# Altium project Hall_Sensor.PrjPcb
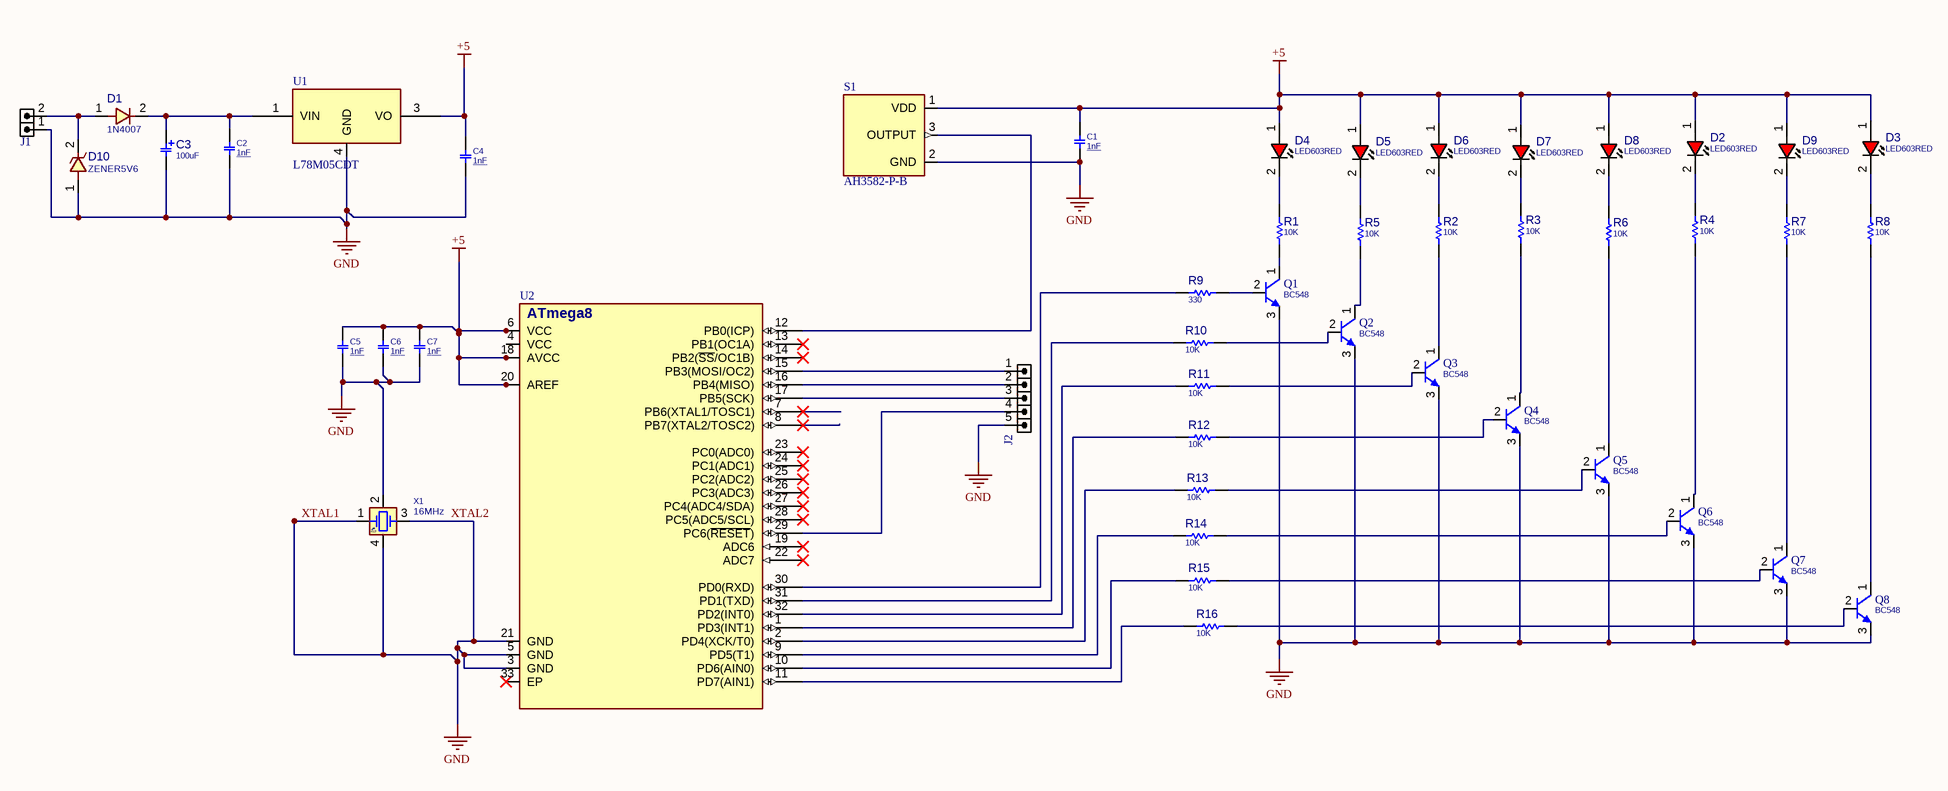
[diagram p0: Shematic_Hall_Sensor_App.SchDoc]
1 sheet, 47 parts. Net scope: global (net labels, ports and power ports of the same name join across sheets).
Board files: PCB_Hall_Sensor.PcbDoc, PCB_Hall_Sensor_Panel.PcbDoc

## Sheet Shematic_Hall_Sensor_App.SchDoc
size 431 x 279 mm; Organization: ORGANIZATION; Address1: ADDRESS 1; Address2: ADDRESS 2; Address3: ADDRESS 3; Address4: ADDRESS 4; Revision: -; SheetNumber: 1; SheetTotal: 1; ENG_APP_DATE: --/--/--; DSN_APP_DATE: --/--/--; CHK_APP_DATE: --/--/--

### Parts
C1  1nF  [C0402]
C2  1nF  [C0402]
C3  100uF  [C_EL_8]
C4  1nF  [C0402]
C5  1nF  [C0402]
C6  1nF  [C0402]
C7  1nF  [C0402]
D1  1N4007  [D_SMA]
D2  LED603RED  [LED0603RED]
D3  LED603RED  [LED0603RED]
D4  LED603RED  [LED0603RED]
D5  LED603RED  [LED0603RED]
D6  LED603RED  [LED0603RED]
D7  LED603RED  [LED0603RED]
D8  LED603RED  [LED0603RED]
D9  LED603RED  [LED0603RED]
D10  ZENER5V6  [D_SOD123W]
J1  HDRM2  [HDR_M_1X2]  (value not drawn)
J2  HDR1X5  [HDR_M_1X5]  (value not drawn)
Q1  BC548  [TO92_3]
Q2  BC548  [TO92_3]
Q3  BC548  [TO92_3]
Q4  BC548  [TO92_3]
Q5  BC548  [TO92_3]
Q6  BC548  [TO92_3]
Q7  BC548  [TO92_3]
Q8  BC548  [TO92_3]
R1  10K  [R0603]
R2  10K  [R0603]
R3  10K  [R0603]
R4  10K  [R0603]
R5  10K  [R0603]
R6  10K  [R0603]
R7  10K  [R0603]
R8  10K  [R0603]
R9  330  [R0603]
R10  10K  [R0603]
R11  10K  [R0603]
R12  10K  [R0603]
R13  10K  [R0603]
R14  10K  [R0603]
R15  10K  [R0603]
R16  10K  [R0603]
S1  AH3582-P-B  [SIP160W38P127L430H495Q3]
U1  L78M05CDT  [DPAK_3]
U2  ATMEGA8  [QFG80_32]  (value not drawn)
X1  16MHz  [XTL_4_2520]

### Nets
+5: C1.1 C4.1 C5.1 C6.1 C7.1 D2.1(ANODE) D3.1(ANODE) D4.1(ANODE) D5.1(ANODE) D6.1(ANODE) D7.1(ANODE) D8.1(ANODE) D9.1(ANODE) S1.1(VDD) U1.3(VO) U2.6(VCC) U2.18(AVCC) U2.20(AREF)
XTAL1: C1.2 C2.2 C3.2 C4.2 C5.2 C6.2 C7.2 D10.1 J1.1 J2.5 Q1.3(E) Q2.3(E) Q3.3(E) Q4.3(E) Q5.3(E) Q6.3(E) Q7.3(E) Q8.3(E) S1.2(GND) U1.4(GND) U2.3(GND) U2.5(GND) U2.21(GND) X1.1 X1.2 X1.3 X1.4  [also labelled GND, XTAL2]
NetC2_1: C2.1 C3.1 D1.2 U1.1(VIN)
NetD1_1: D1.1 D10.2 J1.2
NetD2_2: D2.2(CATHODE) R4.2
NetD3_2: D3.2(CATHODE) R8.2
NetD4_2: D4.2(CATHODE) R1.2
NetD5_2: D5.2(CATHODE) R5.2
NetD6_2: D6.2(CATHODE) R2.2
NetD7_2: D7.2(CATHODE) R3.2
NetD8_2: D8.2(CATHODE) R6.2
NetD9_2: D9.2(CATHODE) R7.2
NetJ2_1: J2.1 U2.15(PB3(MOSI/OC2))
NetJ2_2: J2.2 U2.16(PB4(MISO))
NetJ2_3: J2.3 U2.17(PB5(SCK))
NetJ2_4: J2.4 U2.29(PC6(~{RESET}))
NetQ1_1: Q1.1(C) R1.1
NetQ1_2: Q1.2(B) R9.2
NetQ2_1: Q2.1(C) R5.1
NetQ2_2: Q2.2(B) R10.2
NetQ3_1: Q3.1(C) R2.1
NetQ3_2: Q3.2(B) R11.2
NetQ4_1: Q4.1(C) R3.1
NetQ4_2: Q4.2(B) R12.2
NetQ5_1: Q5.1(C) R6.1
NetQ5_2: Q5.2(B) R13.2
NetQ6_1: Q6.1(C) R4.1
NetQ6_2: Q6.2(B) R14.2
NetQ7_1: Q7.1(C) R7.1
NetQ7_2: Q7.2(B) R15.2
NetQ8_1: Q8.1(C) R8.1
NetQ8_2: Q8.2(B) R16.2
NetR9_1: R9.1 U2.30(PD0(RXD))
NetR10_1: R10.1 U2.31(PD1(TXD))
NetR11_1: R11.1 U2.32(PD2(INT0))
NetR12_1: R12.1 U2.1(PD3(INT1))
NetR13_1: R13.1 U2.2(PD4(XCK/T0))
NetR14_1: R14.1 U2.9(PD5(T1))
NetR15_1: R15.1 U2.10(PD6(AIN0))
NetR16_1: R16.1 U2.11(PD7(AIN1))
NetS1_3: S1.3(OUTPUT) U2.12(PB0(ICP))

Not connected (* = marked no-connect by the designer): U2 4(VCC) 7(PB6(XTAL1/TOSC1))* 8(PB7(XTAL2/TOSC2))* 13(PB1(OC1A))* 14(PB2(~{SS}/OC1B))* 19(ADC6)* 22(ADC7)* 23(PC0(ADC0))* 24(PC1(ADC1))* 25(PC2(ADC2))* 26(PC3(ADC3))* 27(PC4(ADC4/SDA))* 28(PC5(ADC5/SCL))* 33(EP)*

### Notes on the sheet
- DWG. NO.
- REV.
- SHT.
- THIS DOCUMENT AND THE DATA DISCLOSED HEREIN OR HEREWITH IS THE PROPERTY OF ALTIUM LIMITED AND MAY BE FREELY DISTRIBUTED IN WHOLE. NO RIGHTS ARE RESERVED OR EXPRESS OR IMPLIED WARANTEE GIVEN.
- REVISION
- DESCRIPTION
- DATE
- APPROVED
- ENG:
- APPROVALS
- PROJECT
- DSN:
- CHK:
- REFERENCE DOCUMENTS
- PROJECT REVISION:
- TITLE
- DOCUMENT REVISION:
- DESIGN ITEM:
- BOM:
- FAB DWG:
- PCB DWG:
- ASSY DWG:
- SCALE:
- SIZE
- B
- CAGE CODE
- FILE NAME
- DWG NO.
- SHEET
- OF
- REV
- (in symbol ATMEGA8_QFP32) ATmega8

### Library data of the parts
C1 C2 C4-C7 = CAP_SMD_MLCC: CAP, MLCC, 1nF, 50V, C0G, 10%, 0402; MANF_P#: MANF_PART#; MANF: Murata; PARAM: C0G, 10%; PRICE: 100= 1$; DESC: CAP, MLCC, 1nF, 50V, C0G, 10%, 0402; PARAM2: 50V; ASSEMBLY: ASSEMBLY; VALUE: 1nF
C3 = CAP_SMD_EL: CAP, THD, ELEC,; MANF_P#: MANF_PART#; PARAM2: -V; DESC: DESCRIPTION; DIST#: MOUSER; PARAM: 20%; PRICE: 10= -$; MANF: MANF; ASSEMBLY: ASSEMBLY; VALUE: 100uF
D1 = DIODE_SMD_1N4007: DIODE, GENERAL PURPOSE, 1000V/1A; MANF: Kingtronics; DESC: DESCRIPTION; PARAM: 1000V VRRM; PARAM2: 1A; MANF_P#: M7; ASSEMBLY: ASSEMBLY; PRICE: PRICE; VALUE: 1N4007
D2-D9 = LED_SMD_0603_RED: LED, SMD, 0603, RED; PARAM: 30mA, 640nm; DESC: DESCRIPTION; MANF_P#: MANF_PART#; PARAM2: 1.8~2.5V; MANF: MANF; ASSEMBLY: ASSEMBLY; PRICE: PRICE; VALUE: LED603RED
D10 = DIODE_SMD_ZENER_DFLZ5V6: DIODE, ZENER, 1W, 5.1V; MANF: Diodes; DESC: DESCRIPTION; PARAM2: 1W, 4Ohm, -55~150oC; PARAM: 5.6V; MANF_P#: DFLZ5V6-7; ASSEMBLY: ASSEMBLY; PRICE: 0.5$; VALUE: ZENER5V6
J1 = HDR_M_1X2: CONN, HEADER, Male, pitch: 2.54mm, 2POS; VALUE: HDRM2
J2 = HDR_M_1X5: CONN, HEADER, Male, pitch: 2.54mm, 5POS; VALUE: HDRM5
Q1-Q8 = NPN_BC548_TO92: BJT, NPN, 30v, 0.1A, THD, TO92; PARAM2: 500mW; MANF: FAIRCHILD; PARAM: 30v, 0.1A; MANF_P#: BC548; VALUE: BC548
R1-R8 R10-R16 = RES_SMD_0603: RESISTOR, SMD; PARAM: -W; DESC: DESCRIPTION; DIST#: MOUSER; PARAM2: 1%; MANF_P#: -; MANF: -; ASSEMBLY: ASSEMBLY; PRICE: 100= 0.5$; VALUE: 10K
R9 = RES_SMD_0603: RESISTOR, SMD; PARAM: 0.1W; DESC: DESCRIPTION; DIST#: MOUSER; PARAM2: 1%; MANF_P#: -; MANF: -; ASSEMBLY: ASSEMBLY; PRICE: 100= 0.5$; VALUE: 330
S1 = AH3582-P-B: HALL OMNIPOLAR SWITCH,SIP-3,BULK; Package: None; Price: None; Value: *; MP: AH3582-P-B; Availability: Unavailable
U1 = VREG_78M05_TO252: REG, Linear, Fixed, 5v, 0.5A, TO-252; MANF_P#: LM78M05CDT, L7805CDT, MC7805BDT, MC78M05CDT, MC7805BDT, KA7805ERT, NCV7805BDT, BA7805FP, NJM7805DL1A, AS7805ADTR; MANF: TI, ST, FAIRCHILD, ON, NJR, ROHM, DIODES; PARAM: 5v, 0.5A; PARAM2: PARAM2; VALUE: L78M05CDT
U2 = ATMEGA8_QFP32: MCU, AVR, 8-Bit, 8KB, 1KB RAM, 16MHz; PART#ALT: ATmega8-48-88-168-328; MANF_P#: ATMEGA8-16AU; DESC: 512B EEPROM; MANF: ATMEL/MICROCHIP; PARAM2: 4.5~5.5V; PARAM: 8KB, 1KB RAM, 16MHz, -40~85°C; PRICE: 2.5$; VALUE: ATMEGA8
X1 = XTL_4_16MHz_2520: Crystal 16MHz; MANF: ABRACON; MANF_P#: ABM10W-16.0000MHZ-4-D1X-T3; PARAM: 10PPM, -40~85oC; PRICE: 0.8$; VALUE: 16MHz